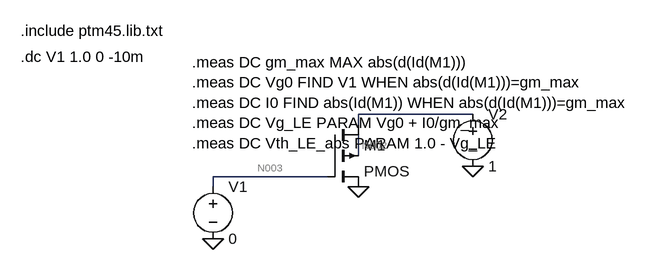
[diagram p0: schematic pmos_char.asc]
pmos_char.asc, the LTspice schematic file:
Version 4
SHEET 1 880 680
WIRE 352 112 176 112
WIRE 176 128 176 112
WIRE 176 176 176 144
WIRE 128 208 -48 208
WIRE -48 224 -48 208
FLAG 176 224 0
FLAG 352 192 0
FLAG -48 304 0
SYMBOL pmos4 128 128 R0
SYMATTR InstName M1
SYMATTR Value2 l=100n w=1u
SYMBOL voltage -48 208 R0
WINDOW 123 0 0 Left 0
WINDOW 39 0 0 Left 0
SYMATTR InstName V1
SYMATTR Value 0
SYMBOL voltage 352 96 R0
SYMATTR InstName V2
SYMATTR Value 1
TEXT -344 -16 Left 2 !.include ptm45.lib.txt
TEXT -344 24 Left 2 !.dc V1 1.0 0 -10m
TEXT -80 32 Left 2 !.meas DC gm_max MAX abs(d(Id(M1)))\n.meas DC Vg0 FIND V1 WHEN abs(d(Id(M1)))=gm_max\n.meas DC I0 FIND abs(Id(M1)) WHEN abs(d(Id(M1)))=gm_max\n.meas DC Vg_LE PARAM Vg0 + I0/gm_max\n.meas DC Vth_LE_abs PARAM 1.0 - Vg_LE

The netlist it stands for:
* pmos_char.asc
M1 N001 N003 0 N002 PMOS l=100n w=1u
V1 N003 0 0
V2 N001 0 1
.model NMOS NMOS
.model PMOS PMOS
.lib standard.mos
.include ptm45.lib.txt
.dc V1 1.0 0 -10m
.meas DC gm_max MAX abs(d(Id(M1)))
.meas DC Vg0 FIND V1 WHEN abs(d(Id(M1)))=gm_max
.meas DC I0 FIND abs(Id(M1)) WHEN abs(d(Id(M1)))=gm_max
.meas DC Vg_LE PARAM Vg0 + I0/gm_max
.meas DC Vth_LE_abs PARAM 1.0 - Vg_LE
.backanno
.end

* Results of the author's LTspice run, read from the files saved beside the schematic
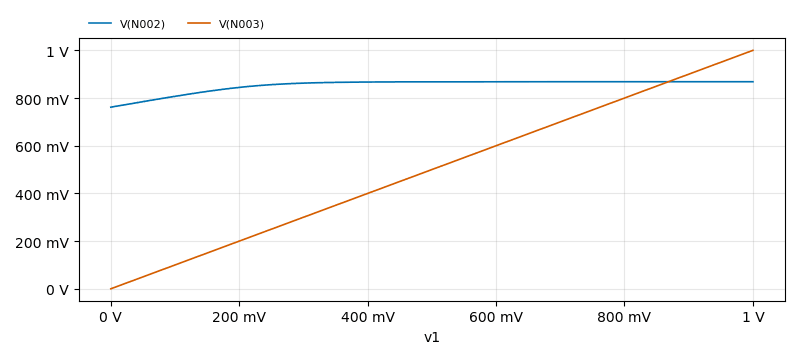
[diagram p1: DC transfer characteristic of pmos_char.asc, plotted from the saved traces]
* DC transfer characteristic, 1 run:
*   V(N002): 868.5 mV at v1=1 V, 761.7 mV at v1=0 V, min 761.7 mV, max 868.5 mV
*   V(N003): 1 V at v1=1 V, 0 V at v1=0 V, min 0 V, max 1 V
* From the log:
*   gm_max: MAX(abs(d(id(m1))))=0.000770728 FROM 1 TO 0
*   vg0: v1=0.009 at 0.009
*   i0: abs(id(m1))=0.000255348 at 0.009
*   vg_le: vg0 + i0/gm_max=0.340308
*   vth_le_abs: 1.0 - vg_le=0.659692